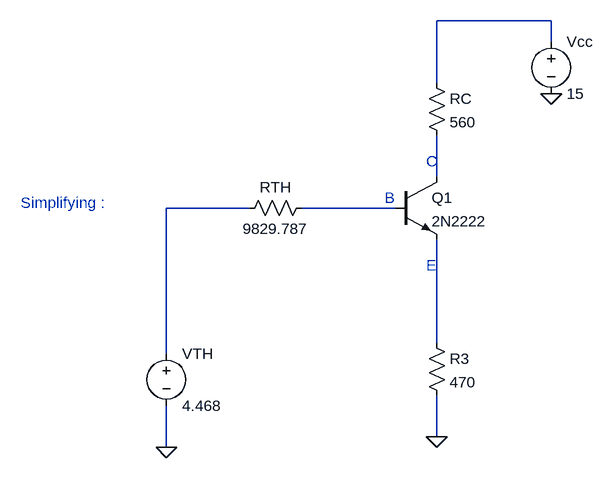
[diagram p0: schematic Step1_simplifyingtoThevenin.asc]
Step1_simplifyingtoThevenin.asc, the LTspice schematic file:
Version 4
SHEET 1 880 680
WIRE 496 -560 320 -560
WIRE 496 -528 496 -560
WIRE 320 -464 320 -560
WIRE 320 -320 320 -384
WIRE 32 -272 -96 -272
WIRE 256 -272 112 -272
WIRE 320 -64 320 -224
WIRE -96 -48 -96 -272
WIRE 320 80 320 16
WIRE -96 96 -96 32
FLAG 496 -448 0
FLAG -96 96 0
FLAG 320 80 0
SYMBOL res 304 -480 R0
SYMATTR InstName RC
SYMATTR Value 560
SYMBOL res 128 -288 R90
WINDOW 0 0 56 VBottom 2
WINDOW 3 32 56 VTop 2
SYMATTR InstName RTH
SYMATTR Value 9829.787
SYMBOL res 304 -80 R0
SYMATTR InstName R3
SYMATTR Value 470
SYMBOL voltage 496 -544 R0
SYMATTR InstName Vcc
SYMATTR Value 15
SYMBOL voltage -96 -64 R0
SYMATTR InstName VTH
SYMATTR Value 4.468
SYMBOL npn 256 -320 R0
SYMATTR InstName Q1
SYMATTR Value 2N2222
TEXT 304 -184 Left 2 ;E
TEXT 304 -344 Left 2 ;C
TEXT 240 -288 Left 2 ;B
TEXT -320 -280 Left 2 ;Simplifying :

The netlist it stands for:
* Step1_simplifyingtoThevenin.asc
RC N001 N002 560
RTH N004 N003 9829.787
R3 N005 0 470
Vcc N001 0 15
VTH N003 0 4.468
Q1 N002 N004 N005 0 2N2222
.model NPN NPN
.model PNP PNP
.lib standard.bjt
* E
* C
* B
* Simplifying :
.backanno
.end